# EAGLE schematic Controle_4_reles V4 (EAGLE 4.09)

## Sheet 1 of 3
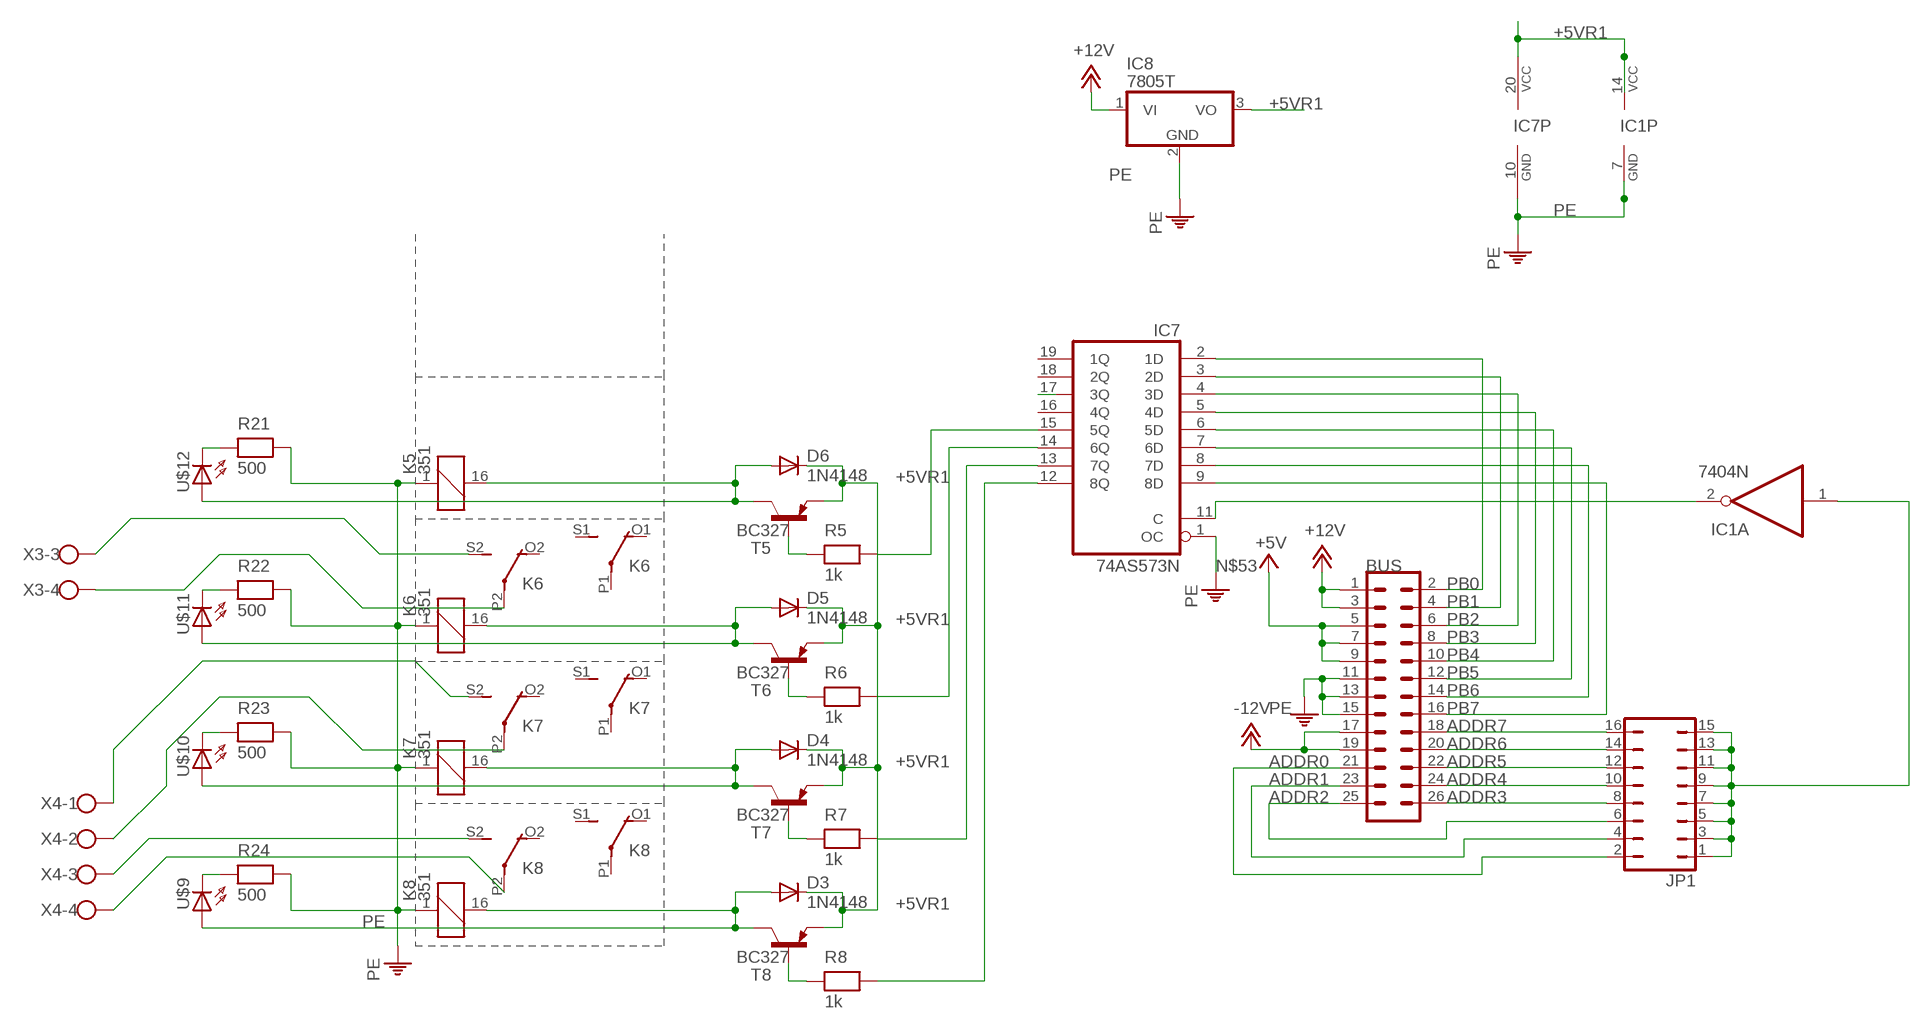
[diagram p0: schematic, sheet 1]

### Parts
BUS  ML26  [ML26]
D3  1N4148  [DO35-10]
D4  1N4148  [DO35-10]
D5  1N4148  [DO35-10]
D6  1N4148  [DO35-10]
IC1  7404N  [DIL14]
IC7  74AS573N  [DIL20]
IC8  7805T  [TO220H]
JP1  JP8Q  [JP8Q]
K5  351  [351]
K6  351  [351]
K7  351  [351]
K8  351  [351]
R5  1k  RESEU-10  [R-10]
R6  1k  RESEU-10  [R-10]
R7  1k  RESEU-10  [R-10]
R8  1k  RESEU-10  [R-10]
R21  500  RESEU-10  [R-10]
R22  500  RESEU-10  [R-10]
R23  500  RESEU-10  [R-10]
R24  500  RESEU-10  [R-10]
T5  BC327  [TO92]
T6  BC327  [TO92]
T7  BC327  [TO92]
T8  BC327  [TO92]
U$9  LED3MM  [LED3MM]
U$10  LED3MM  [LED3MM]
U$11  LED3MM  [LED3MM]
U$12  LED3MM  [LED3MM]
X3  AK500/4  [AK500/4]
X4  AK500/4  [AK500/4]

### Nets
+5V: BUS.5 BUS.7 BUS.9
+5VR1: D3.C D4.C D5.C D6.C IC1.14(P:VCC) IC7.20(VCC) IC8.3(VO) T5.1(E) T6.1(E) T7.1(E) T8.1(E)
+12V: BUS.1 BUS.3 IC8.1(VI)
-12V: BUS.17 BUS.19
ADDR0: BUS.21 JP1.2
ADDR1: BUS.23 JP1.4
ADDR2: BUS.25 JP1.6
ADDR3: BUS.26 JP1.8
ADDR4: BUS.24 JP1.10
ADDR5: BUS.22 JP1.12
ADDR6: BUS.20 JP1.14
ADDR7: BUS.18 JP1.16
N$1: K8.S2(3:S) X4.3
N$2: R5.1 T5.2(B)
N$7: IC7.12(8Q) R8.2
N$8: IC7.13(7Q) R7.2
N$9: IC7.14(6Q) R6.2
N$13: IC7.17(3Q)
N$15: D6.A K5.16 T5.3(C) U$12.A
N$16: K7.S2(3:S) X4.1
N$20: R6.1 T6.2(B)
N$23: D5.A K6.16 T6.3(C) U$11.A
N$26: R7.1 T7.2(B)
N$27: D4.A K7.16 T7.3(C) U$10.A
N$28: R8.1 T8.2(B)
N$29: D3.A K8.16 T8.3(C) U$9.A
N$30: IC7.15(5Q) R5.2
N$33: IC1.1(A:I) JP1.1 JP1.3 JP1.5 JP1.7 JP1.9 JP1.11 JP1.13 JP1.15
N$34: K6.S2(3:S) X3.3
N$37: K6.P2(3:P) X3.4
N$39: K8.P2(3:P) X4.4
N$45: K7.P2(3:P) X4.2
N$53: IC1.2(A:O) IC7.11(C)
N$150: R21.1 U$12.K(C)
N$153: R22.1 U$11.K(C)
N$156: R23.1 U$10.K(C)
N$160: R24.1 U$9.K(C)
PB0: BUS.2 IC7.2(1D)
PB1: BUS.4 IC7.3(2D)
PB2: BUS.6 IC7.4(3D)
PB3: BUS.8 IC7.5(4D)
PB4: BUS.10 IC7.6(5D)
PB5: BUS.12 IC7.7(6D)
PB6: BUS.14 IC7.8(7D)
PB7: BUS.16 IC7.9(8D)
PE: BUS.11 BUS.13 BUS.15 IC1.7(P:GND) IC7.1(OC) IC7.10(GND) IC8.2(GND) K5.1 K6.1 K7.1 K8.1 R21.2 R22.2 R23.2 R24.2
Unconnected: IC1.3(B:I) IC1.4(B:O) IC1.5(C:I) IC1.6(C:O) IC1.8(D:O) IC1.9(D:I) IC1.10(E:O) IC1.11(E:I) IC1.12(F:O) IC1.13(F:I) IC7.16(4Q) IC7.18(2Q) IC7.19(1Q) K5.O1(2:O) K5.O2(3:O) K5.P1(2:P) K5.P2(3:P) K5.S1(2:S) K5.S2(3:S) K6.O1(2:O) K6.O2(3:O) K6.P1(2:P) K6.S1(2:S) K7.O1(2:O) K7.O2(3:O) K7.P1(2:P) K7.S1(2:S) K8.O1(2:O) K8.O2(3:O) K8.P1(2:P) K8.S1(2:S) X3.1 X3.2

## Sheet 2 of 3

## Sheet 3 of 3

## Library data of the parts
BUS = con-harting-ml:ML26: HARTING
D3-D6 = diode:1N4148: DIODE high speed (Philips)
IC1 = 74xx-us:74*04: Hex INVERTER
IC7 = 74xx-us:74*573: 8-bit D latch BUS DRIVER
IC8 = linear:78*: Positive VOLTAGE REGULATOR
JP1 = jumper:JP8Q: JUMPER
K5-K8 = relay:351: RELAY 2 x switch, Omron
R5-R8 R21-R24 = discrete:RESEU-10
T5-T8 = transistor-pnp:BC327: PNP Transistor
U$9-U$12 = led:LED: LED
X3 X4 = con-ptr500:AK500/4: CONNECTOR